# EAGLE schematic flight comp v5 (EAGLE 9.4.2)
CNAME: FLIGHT COMPUTER; COMPANY: NAKUJA PROJECT; CREVISION: V5; DESIGNER: MICHAEL KIMANI
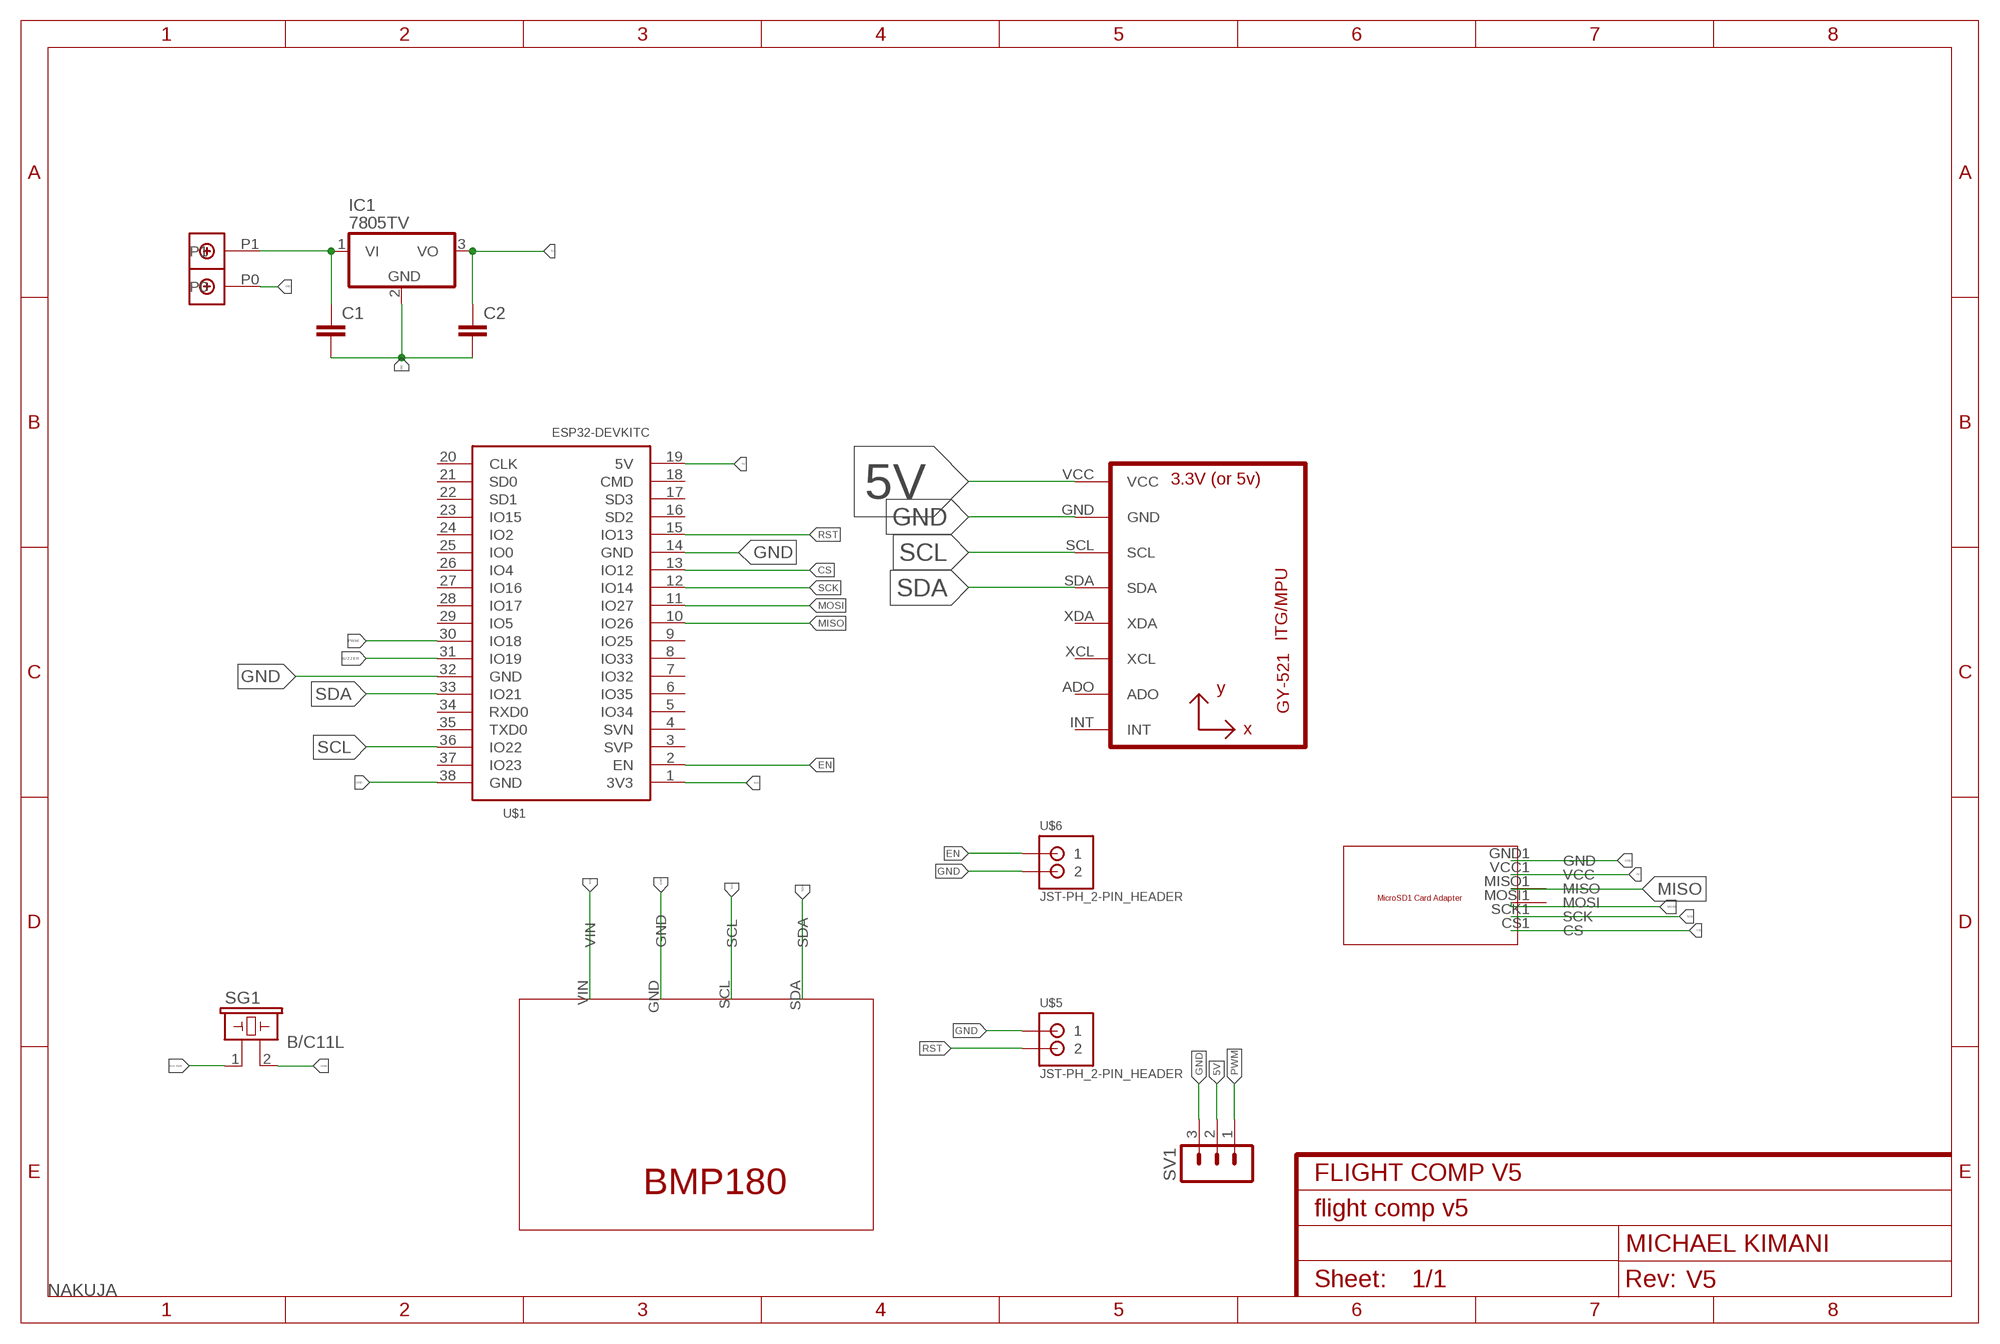
[diagram p0: schematic, sheet 1]
FRAME1 (FRAME-A4L): CNAME: FLIGHT COMP V5; COMPANY: NAKUJA; CREVISION: V5; DESIGNER: MICHAEL KIMANI

## Parts
C1  C2,5-3  [C2.5-3]
C2  C2,5-3  [C2.5-3]
IC1  7805TV  [TO220V]
SG1  B/C11L  [B/C11L]
SV1  MA03-1  [MA03-1]
U1  GY-521MPU6050  [GY-521]
U$1  ESP32DEVKITC  [ESP32-DEVKITC]
U$2  MICROSDADAPTER  [MICROSDADAPTER]
U$3  BMP180  [BMP180]
U$4  DBCONN-1X2  [DBCONN-1X2]
U$5  JST-PH_2-PIN_HEADER  [JST_B2B-PH_HEADER]
U$6  JST-PH_2-PIN_HEADER  [JST_B2B-PH_HEADER]

## Nets
3V3: U$1.1(3V3) U$3.VIN
5V: C2.1 IC1.3(VO) SV1.2 U1.VCC U$1.19(5V) U$2.VCC1(VCC)
BUZZER: SG1.1 U$1.31(IO19)
CS: U$1.13(IO12) U$2.CS1(CS)
EN: U$1.2(EN) U$6.P1
GND: C1.2 C2.2 IC1.2(GND) SG1.2 SV1.3 U1.GND U$1.14(GND) U$1.32(GND) U$1.38(GND) U$2.GND1(GND) U$3.GND U$4.P0 U$5.P1 U$6.P2
MISO: U$1.10(IO26) U$2.MISO1(MISO)
MOSI: U$1.11(IO27) U$2.MOSI1(MOSI)
N$1: C1.1 IC1.1(VI) U$4.P1
PWM: SV1.1 U$1.30(IO18)
RST: U$1.15(IO13) U$5.P2
SCK: U$1.12(IO14) U$2.SCK1(SCK)
SCL: U1.SCL U$1.36(IO22) U$3.SCL
SDA: U1.SDA U$1.33(IO21) U$3.SDA
Unconnected: U1.ADO U1.INT U1.XCL U1.XDA U$1.3(SVP) U$1.4(SVN) U$1.5(IO34) U$1.6(IO35) U$1.7(IO32) U$1.8(IO33) U$1.9(IO25) U$1.16(SD2) U$1.17(SD3) U$1.18(CMD) U$1.20(CLK) U$1.21(SD0) U$1.22(SD1) U$1.23(IO15) U$1.24(IO2) U$1.25(IO0) U$1.26(IO4) U$1.27(IO16) U$1.28(IO17) U$1.29(IO5) U$1.34(RXD0) U$1.35(TXD0) U$1.37(IO23)

## Library data of the parts
C1 C2 = capacitor-wima:C: CAPACITOR naming: grid - package width
IC1 = linear:78*: Positive VOLTAGE REGULATOR Source: http://cache.national.com/ds/LM/LM78L05.pdf http://www.fairchildsemi.com/ds/LM/LM7805.pdf
SG1 = buzzer:B/C11L: BUZZER Source: Buerklin; OC_FARNELL: unknown; OC_NEWARK: unknown
SV1 = con-lstb:MA03-1: PIN HEADER; OC_FARNELL: unknown; OC_NEWARK: unknown
U1 = gy-521:GY-521
U$1 = ESP32-DEVKITC:ESP32DEVKITC
U$2 = MicroSD Card Adapter:MICROSDADAPTER
U$3 = bmp1802:BMP180
U$4 = Terminal Block Connector:DBCONN-1X2
U$5 U$6 = srg:JST-PH_2-PIN_HEADER: 2-pin JST PH Shrouded Header, top entry P/N B2B-PH-K-S Mating connector PHR-2 Mating cable assembly: Sparkfun PRT-09914 <http://www.sparkfun.com/products/9914>